# Altium schematic sheet Host.SchDoc: MCU
size A4; DocumentNumber: 3; SheetNumber: 3; SheetTotal: 5
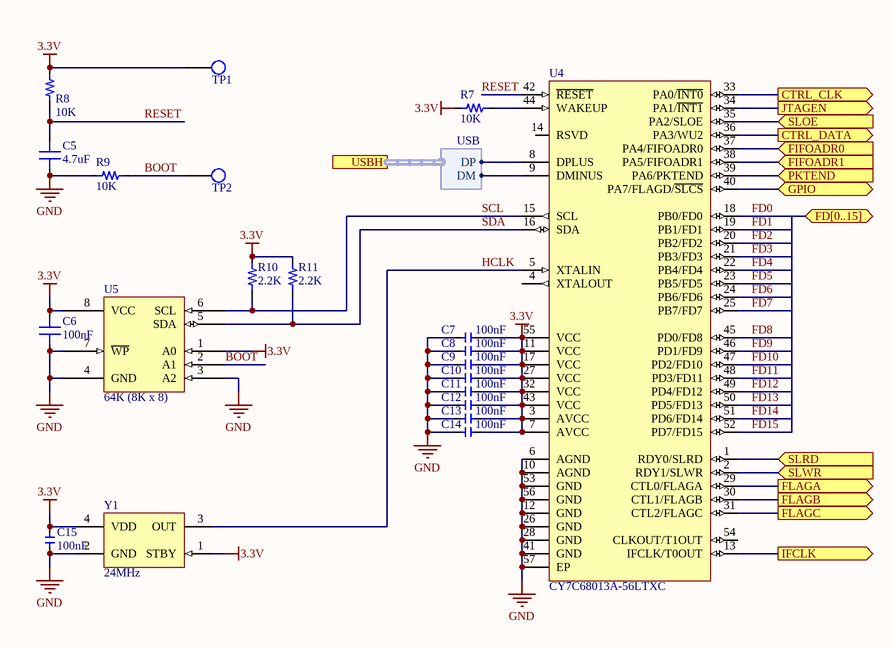
[diagram p0: Host.SchDoc]

## Parts
C5  4.7uF  [CAP 0402/1005]
C6  100nF  [CAP 0402/1005]
C7  100nF  [CAP 0402/1005]
C8  100nF  [CAP 0402/1005]
C9  100nF  [CAP 0402/1005]
C10  100nF  [CAP 0402/1005]
C11  100nF  [CAP 0402/1005]
C12  100nF  [CAP 0402/1005]
C13  100nF  [CAP 0402/1005]
C14  100nF  [CAP 0402/1005]
C15  100nF  [CAP 0402/1005]
R7  10K  [RES 0402/1005]
R8  10K  [RES 0402/1005]
R9  10K  [RES 0402/1005]
R10  2.2K  [RES 0402/1005]
R11  2.2K  [RES 0402/1005]
TP1  Test Point  [TP 1MM]  (value not drawn)  (no BOM)
TP2  Test Point  [TP 1MM]  (value not drawn)  (no BOM)
U4  CY7C68013A-56LTXC  [QFN50P800X800X90_HS-57N]
U5  64K (8K x 8)  [MICROCHIP TSSOP-8 ST]
Y1  24MHz  [WE-SPXO_IQXO-540]

## Ports
CTRL_CLK (out), CTRL_DATA (out), FD[0..15] (bidir), FIFOADR0 (in), FIFOADR1 (in), FLAGA (out), FLAGB (out), FLAGC (out), GPIO (bidir), IFCLK (out), JTAGEN (out), PKTEND (in), SLOE (in), SLRD (in), SLWR (in), USBH (harness USB)

## Harnesses
USB: DP, DM

## Nets
3.3V: C6.1 C7.1 C8.2 C9.2 C10.2 C11.2 C12.2 C13.2 C14.2 C15.1 R7.2 R8.2 R10.2 R11.2 TP1.1 U4.3(AVCC) U4.7(AVCC) U4.11(VCC) U4.17(VCC) U4.27(VCC) U4.32(VCC) U4.43(VCC) U4.55(VCC) U5.1(A0) U5.8(VCC) Y1.1(STBY) Y1.4(VDD)
GND: C5.2 C6.2 C7.2 C8.1 C9.1 C10.1 C11.1 C12.1 C13.1 C14.1 C15.2 R9.1 U4.6(AGND) U4.10(AGND) U4.12(GND) U4.26(GND) U4.28(GND) U4.41(GND) U4.53(GND) U4.56(GND) U4.57(EP) U5.3(A2) U5.4(GND) U5.7(~{WP}) Y1.2(GND)
BOOT: R9.2 TP2.1 U5.2(A1)
CTRL_CLK: U4.33(PA0/~{INT0}) ; port CTRL_CLK
CTRL_DATA: U4.36(PA3/WU2) ; port CTRL_DATA
FD0: U4.18(PB0/FD0)
FD1: U4.19(PB1/FD1)
FD2: U4.20(PB2/FD2)
FD3: U4.21(PB3/FD3)
FD4: U4.22(PB4/FD4)
FD5: U4.23(PB5/FD5)
FD6: U4.24(PB6/FD6)
FD7: U4.25(PB7/FD7)
FD8: U4.45(PD0/FD8)
FD9: U4.46(PD1/FD9)
FD10: U4.47(PD2/FD10)
FD11: U4.48(PD3/FD11)
FD12: U4.49(PD4/FD12)
FD13: U4.50(PD5/FD13)
FD14: U4.51(PD6/FD14)
FD15: U4.52(PD7/FD15)
FIFOADR0: U4.37(PA4/FIFOADR0) ; port FIFOADR0
FIFOADR1: U4.38(PA5/FIFOADR1) ; port FIFOADR1
FLAGA: U4.29(CTL0/FLAGA) ; port FLAGA
FLAGB: U4.30(CTL1/FLAGB) ; port FLAGB
FLAGC: U4.31(CTL2/FLAGC) ; port FLAGC
GPIO: U4.40(PA7/FLAGD/~{SLCS}) ; port GPIO
HCLK: U4.5(XTALIN) Y1.3(OUT)
IFCLK: U4.13(IFCLK/T0OUT) ; port IFCLK
JTAGEN: U4.34(PA1/~{INT1}) ; port JTAGEN
PKTEND: U4.39(PA6/PKTEND) ; port PKTEND
RESET: C5.1 R8.1 U4.42(~{RESET})
SCL: R10.1 U4.15(SCL) U5.6(SCL)
SDA: R11.1 U4.16(SDA) U5.5(SDA)
SLOE: U4.35(PA2/SLOE) ; port SLOE
SLRD: U4.1(RDY0/SLRD) ; port SLRD
SLWR: U4.2(RDY1/SLWR) ; port SLWR
NetR7_1: R7.1 U4.44(WAKEUP)
NetU4_8: U4.8(DPLUS) ; port USBH.DP
NetU4_9: U4.9(DMINUS) ; port USBH.DM

Not connected (* = marked no-connect by the designer): U4 4(XTALOUT) 14(RSVD) 54(CLKOUT/T1OUT)

## Notes on the sheet
- Title
- Size:
- Date:
- A4
- Number:
- Time:
- Revision:
- Sheet
- of
- File:

## Library data of the parts
C5 = CM0507: CAP CER 4.7UF 6.3V X5R 0402; Part Number: GRM155R60J475ME87D; Manufacturer: Murata; TemperatureRange: -55C ~ 85C; Tolerance: 20%; PartId: CM0507; Value: 4.7uF; Supplier 1: Digi-Key; Supplier Part Number 1: 490-5408-2-ND; ComponentLink1Description: Datasheet; ComponentLink1URL: http://www.murata.com/~/media/webrenewal/support/library/catalog/products/capacitor/mlcc/c02e.pdf; ComponentLink2Description: Digi-Key Listing; ComponentLink2URL: https://www.digikey.com/product-detail/en/murata-electronics-north-america/GRM155R60J475ME87D/490-5408-2-ND/2175194; TemperatureCoefficient: X5R; Voltage: 6.3V; Price: 0.0194; Device Package: 0402 (1005 Metric)
C6-C15 = CM0464: CAP CER 100NF 25V X5R 0402; Part Number: GRM155R61E104KA87D; Manufacturer: Murata; TemperatureRange: -55C ~ 85C; Tolerance: 10%; Value: 100nF; PartId: CM0464; Supplier 1: Digi-Key; Supplier Part Number 1: 490-5920-2-ND; ComponentLink1Description: Datasheet; ComponentLink1URL: http://www.murata.com/~/media/webrenewal/support/library/catalog/products/capacitor/mlcc/c02e.pdf; ComponentLink2Description: Digi-Key Listing; ComponentLink2URL: https://www.digikey.com/product-detail/en/murata-electronics-north-america/GRM155R61E104KA87D/490-5920-2-ND/3693681; TemperatureCoefficient: X5R; Voltage: 25V; Price: 0.0048; Device Package: 0402 (1005 Metric)
R7-R9 = RC1531: RES SMD 10K OHM 1% 1/16W 0402; Part Number: RC0402FR-0710KL; Manufacturer: Yageo; TemperatureRange: -55C ~ 155C; TemperatureCoefficient: 100ppm/C; PowerRating: 0.0625W, 1/16W; PartId: RC1531; Value: 10K; Supplier 1: Mouser; Supplier Part Number 1: 603-RC0402FR-0710KL; ComponentLink1Description: Datasheet; ComponentLink1URL: http://www.yageo.com/NewPortal/yageodocoutput?fileName=/pdf/R-Chip/PYu-RC_Group_51_RoHS_L_9.pdf; Tolerance: 1%; Price: 0.0043; Type: Thick Film; Device Package: 0402 (1005 Metric)
R10 R11 = RC1434: RES SMD 2.2K OHM 1% 1/16W 0402; Part Number: RC0402FR-072K2L; Manufacturer: Yageo; TemperatureRange: -55C ~ 155C; TemperatureCoefficient: 100ppm/C; PowerRating: 0.0625W, 1/16W; PartId: RC1434; Value: 2.2K; Supplier 1: Mouser; Supplier Part Number 1: 603-RC0402FR-072K2L; ComponentLink1Description: Datasheet; ComponentLink1URL: http://www.yageo.com/NewPortal/yageodocoutput?fileName=/pdf/R-Chip/PYu-RC_Group_51_RoHS_L_9.pdf; Tolerance: 1%; Price: 0.0043; Type: Thick Film; Device Package: 0402 (1005 Metric)
U4 = IIF024: MCU USB PHERIPH FX2LP 56VQFN; Manufacturer: Infineon; PartId: IIF024; Part Number: CY7C68013A-56LTXC; Supplier 1: Digi-Key; Supplier Part Number 1: 448-CY7C68013A-56LTXC-ND; Supplier 2: Mouser; Supplier Part Number 2: 727-CY7C68013A56LTXC; ComponentLink1Description: Datasheet; ComponentLink1URL: https://www.infineon.com/dgdl/Infineon-CY7C68013A_CY7C68014A_CY7C68015A_CY7C68016A_EZ-USB_FX2LP_USB_Microcontroller_High-Speed_USB_Peripheral_Controller-DataSheet-v31_00-EN.pdf?fileId=8ac78c8c7d0d8da4017d0ec9f7974252; Price: 12; Type: USB Microcontroller; Device Package: 56-QFN (8x8); Operating Temperature: 0C ~ 70C
U5 = ME0028: IC EEPROM 64KBIT 400KHZ 8TSSOP; Part Number: 24LC64-I/ST; Manufacturer: Microchip Technology; Interface: I2C, 2-Wire Serial; Voltage - Supply: 2.5 V ~ 5.5 V; PartId: ME0028; Supplier 1: Digi-Key; Supplier Part Number 1: 24LC64-I/ST-ND; ComponentLink1Description: Datasheet; ComponentLink1URL: http://www.microchip.com/mymicrochip/filehandler.aspx?ddocname=en011843; ComponentLink2Description: Digi-Key Listing; ComponentLink2URL: http://www.digikey.com/product-detail/en/24LC64-I%2FST/24LC64-I%2FST-ND/443537; Price: 0.42; Type: EEPROM; Device Package: 8-TSSOP (0.173", 4.40mm Width); Operating Temperature: -40C ~ 85C; Memory Type: EEPROM; Memory Size: 64K (8K x 8); Speed: 400kHz
Y1 = OX0029: OSC XO 24MHz 3.3V 2016 SMD; Part Number: 830208215109; Manufacturer: Wurth; Frequency Stability: 25ppm; Load Capacitance: 15pF; PartId: OX0029; Value: 24MHz; Supplier 1: Mouser; Supplier Part Number 1: 710-830208215109; ComponentLink1Description: Datasheet; ComponentLink1URL: https://www.we-online.com/redexpert/spec/830208215109?ad; Price: 0.4; Type: XO (Standard); Device Package: 4-SMD, 2016; Series: IQXO-540; Frequency: 24MHz; Supply Voltage: 3.3V
TP1 TP2 = Test Point: PartId: Test Point; Component Type: Standard (No BOM); Pin Count: 1